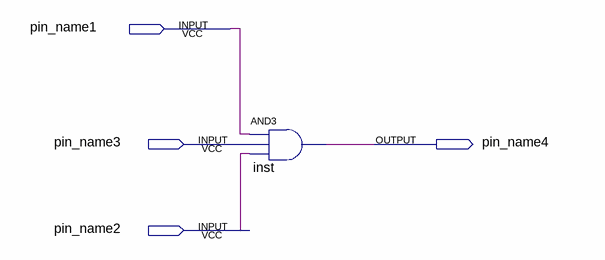
[diagram p0: schematic sheet]
// Quartus schematic ProyectoHD.bdf as structural Verilog: 1 symbols, 4 pins
module ProyectoHD (
  input  pin_name1,
  input  pin_name3,
  input  pin_name2,
  output pin_name4
);

  and inst (pin_name4, pin_name1, pin_name3, pin_name2);
endmodule
